# EAGLE design Hscope_102 (EAGLE 9.6.2)
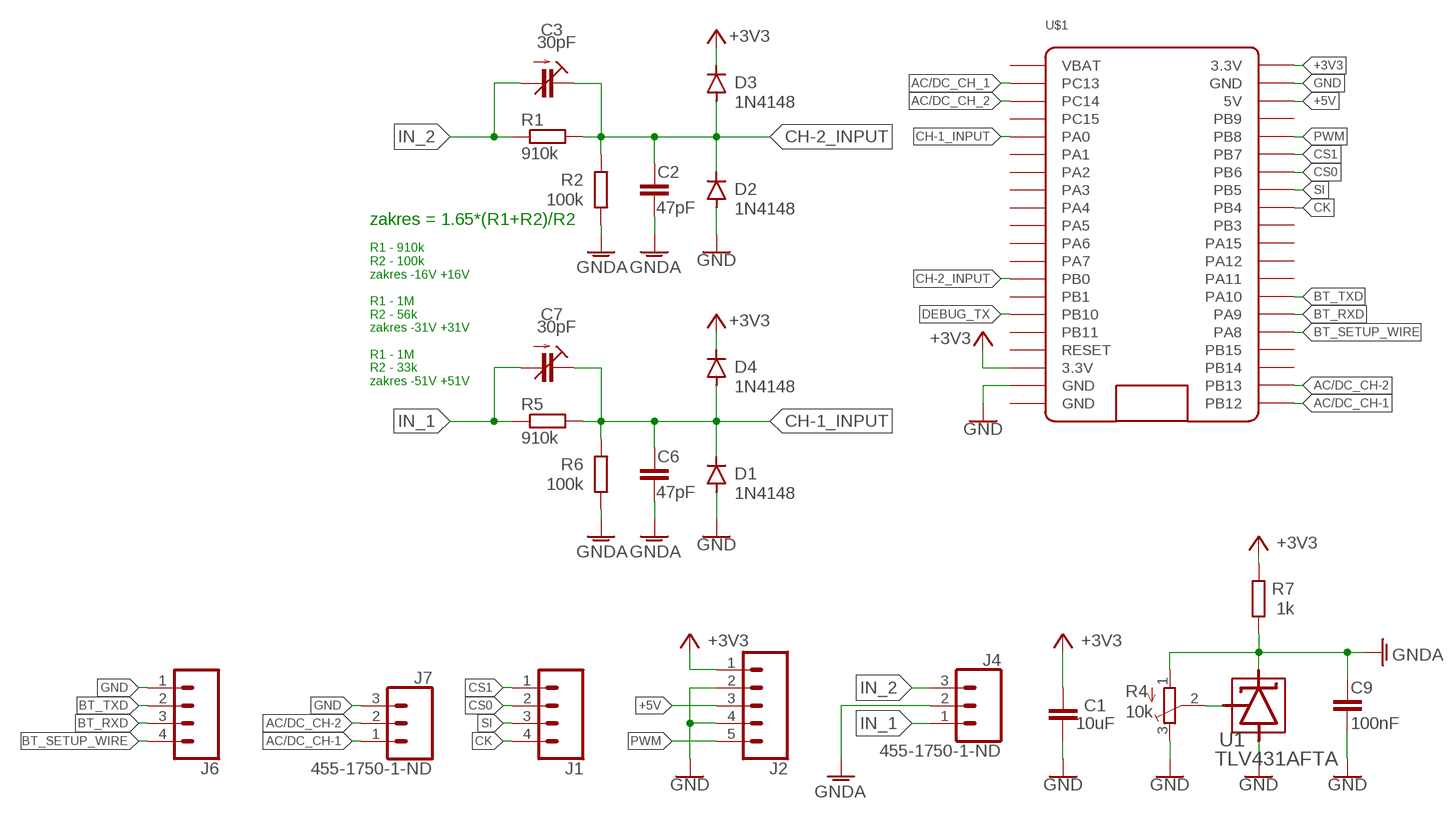
[diagram p0: schematic, sheet 1]

## Parts
C1  10uF  C-EUC0805  [C0805]
C2  47pF  C-EUC0805  [C0805]
C3  30pF  C-TRIMM3018_12  [CTRIM3018_12]
C6  47pF  C-EUC0805  [C0805]
C7  30pF  C-TRIMM3018_12  [CTRIM3018_12]
C9  100nF  C-EUC0805  [C0805]
D1  1N4148  DIODE-SOD323-W  [SOD323-W]
D2  1N4148  DIODE-SOD323-W  [SOD323-W]
D3  1N4148  DIODE-SOD323-W  [SOD323-W]
D4  1N4148  DIODE-SOD323-W  [SOD323-W]
J1  CONN_04PTH  [1X04]
J2  CONN_05  [1X05]
J4  455-1750-1-ND  CONN_03  [1X03]
J6  CONN_04PTH  [1X04]
J7  455-1750-1-ND  CONN_03  [1X03]
R1  910k  R-EU_R0805  [R0805]
R2  100k  R-EU_R0805  [R0805]
R4  10k  TRIM_EU-SM-42/43A  [SM-42/43A]
R5  910k  R-EU_R0805  [R0805]
R6  100k  R-EU_R0805  [R0805]
R7  1k  R-EU_R0805  [R0805]
U1  TLV431AFTA  [SOT95P237X112-3N]
U$1  STM32_BLUEPILL  [STM32_BLUEPILL]

## Nets
+3V3: C1.2 D3.C D4.C J2.1 R7.2 U$1.P$20(3.3V) U$1.P$23(3.3V)
+5V: J2.3 U$1.P$18(5V)
AC/DC_CH-1: J7.1 U$1.P$1(PB12)
AC/DC_CH-2: J7.2 U$1.P$2(PB13)
AC/DC_CH_1: U$1.P$39(PC13)
AC/DC_CH_2: U$1.P$38(PC14)
BT_RXD: J6.3 U$1.P$6(PA9)
BT_SETUP_WIRE: J6.4 U$1.P$5(PA8)
BT_TXD: J6.2 U$1.P$7(PA10)
CH-1_INPUT: C6.2 C7.+(E) D1.C D4.A R5.2 R6.2 U$1.P$36(PA0)
CH-2_INPUT: C2.2 C3.+(E) D2.C D3.A R1.2 R2.2 U$1.P$28(PB0)
CK: J1.4 U$1.P$12(PB4)
CS0: J1.2 U$1.P$14(PB6)
CS1: J1.1 U$1.P$15(PB7)
DEBUG_TX: U$1.P$26(PB10)
GND: C1.1 C9.1 D1.A D2.A J2.2 J2.4 J6.1 J7.3 R4.3(E) U1.3(ANODE) U$1.P$19(GND) U$1.P$22(GND)
GNDA: C2.1 C6.1 C9.2 J4.2 R2.1 R4.1(A) R6.1 R7.1 U1.2(CATHODE)
IN_1: C7.-(A) J4.1 R5.1
IN_2: C3.-(A) J4.3 R1.1
N$1: R4.2(S) U1.1(REF)
PWM: J2.5 U$1.P$16(PB8)
SI: J1.3 U$1.P$13(PB5)
Unconnected: U$1.P$3(PB14) U$1.P$4(PB15) U$1.P$8(PA11) U$1.P$9(PA12) U$1.P$10(PA15) U$1.P$11(PB3) U$1.P$17(PB9) U$1.P$24(RESET) U$1.P$25(PB11) U$1.P$27(PB1) U$1.P$29(PA7) U$1.P$30(PA6) U$1.P$31(PA5) U$1.P$32(PA4) U$1.P$33(PA3) U$1.P$34(PA2) U$1.P$35(PA1) U$1.P$37(PC15)

## Notes on the sheet
- zakres = 1.65*(R1+R2)/R2
- R1 - 910k
  R2 - 100k
  zakres -16V +16V
  
  R1 - 1M
  R2 - 56k
  zakres -31V +31V
  
  R1 - 1M
  R2 - 33k
  zakres -51V +51V

## Power pins joined to a net without a drawn wire
GND: U$1.P$21(GND)
VBAT: U$1.P$40(VBAT)

## Library data of the parts
C1 C2 C6 C9 = rlc:C-EU: CAPACITOR, European symbol
C3 C7 = rlc:C-TRIMM: Trimm capacitor
D1-D4 = diode:DIODE-: DIODE
J1 J6 = SparkFun-Connectors:CONN_04: Multi connection point. Often used as Generic Header-pin footprint for 0.1 inch spaced/style header connections On any of the 0.1 inch spaced packages, you can populate with these: Break Away Headers - Straight <https://www.sparkfun.com/products/116> (PRT-00116) Break Away Male Headers - Right Angle <https://www.sparkfun.com/products/553> (PRT-00553) Female Headers <https://www.sparkfun.com/products/115> (PRT-00115) Break Away Headers - Machine Pin <https://www.sparkfun.com/products/117> (PRT-00117) Break Away Female Headers - Swiss Machine Pin <https://www.sparkfun.com/products/743> (PRT-00743) For SCREWTERMINALS and SPRING TERMINALS visit here: Screw Terimnals on SparkFun.com <https://www.sparkfun.com/search/results?term=Screw+Terminals> (5mm/3.5mm/2.54mm spacing) This device is also useful as a general connection point to wire up your design to another part of your project. Our various solder wires solder well into these plated through hole pads. Hook-Up Wire - Assortment (Stranded, 22 AWG) <https://www.sparkfun.com/products/11375> (PRT-11375) Hook-Up Wire - Assortment (Solid Core, 22 AWG) <https://www.sparkfun.com/products/11367> (PRT-11367) View the entire wire category on our website here <https://www.sparkfun.com/categories/141> Special notes: Molex polarized connector foot print use with SKU : PRT-08231 with associated crimp pins and housings. 1MM SMD Version SKU: PRT-10208; PROD_ID: CONN-09696
J2 = SparkFun-Connectors:CONN_05: Multi connection point. Often used as Generic Header-pin footprint for 0.1 inch spaced/style header connections On any of the 0.1 inch spaced packages, you can populate with these: Break Away Headers - Straight <https://www.sparkfun.com/products/116> (PRT-00116) Break Away Male Headers - Right Angle <https://www.sparkfun.com/products/553> (PRT-00553) Female Headers <https://www.sparkfun.com/products/115> (PRT-00115) Break Away Headers - Machine Pin <https://www.sparkfun.com/products/117> (PRT-00117) Break Away Female Headers - Swiss Machine Pin <https://www.sparkfun.com/products/743> (PRT-00743) For SCREWTERMINALS and SPRING TERMINALS visit here: Screw Terimnals on SparkFun.com <https://www.sparkfun.com/search/results?term=Screw+Terminals> (5mm/3.5mm/2.54mm spacing) This device is also useful as a general connection point to wire up your design to another part of your project. Our various solder wires solder well into these plated through hole pads. Hook-Up Wire - Assortment (Stranded, 22 AWG) <https://www.sparkfun.com/products/11375> (PRT-11375) Hook-Up Wire - Assortment (Solid Core, 22 AWG) <https://www.sparkfun.com/products/11367> (PRT-11367) View the entire wire category on our website here <https://www.sparkfun.com/categories/141> Special notes: Molex polarized connector foot print use with SKU : PRT-08231 with associated crimp pins and housings. 1MM SMD Version SKU: PRT-10208
J4 J7 = SparkFun-Connectors:CONN_03: Multi connection point. Often used as Generic Header-pin footprint for 0.1 inch spaced/style header connections On any of the 0.1 inch spaced packages, you can populate with these: Break Away Headers - Straight <https://www.sparkfun.com/products/116> (PRT-00116) Break Away Male Headers - Right Angle <https://www.sparkfun.com/products/553> (PRT-00553) Female Headers <https://www.sparkfun.com/products/115> (PRT-00115) Break Away Headers - Machine Pin <https://www.sparkfun.com/products/117> (PRT-00117) Break Away Female Headers - Swiss Machine Pin <https://www.sparkfun.com/products/743> (PRT-00743) Stackable Header - 3 Pin (Female, 0.1") <https://www.sparkfun.com/products/13875> (PRT-13875) For SCREWTERMINALS and SPRING TERMINALS visit here: Screw Terimnals on SparkFun.com <https://www.sparkfun.com/search/results?term=Screw+Terminals> (5mm/3.5mm/2.54mm spacing) This device is also useful as a general connection point to wire up your design to another part of your project. Our various solder wires solder well into these plated through hole pads. Hook-Up Wire - Assortment (Stranded, 22 AWG) <https://www.sparkfun.com/products/11375> (PRT-11375) Hook-Up Wire - Assortment (Solid Core, 22 AWG) <https://www.sparkfun.com/products/11367> (PRT-11367) View the entire wire category on our website here <https://www.sparkfun.com/categories/141> Special notes: Molex polarized connector foot print use with SKU : PRT-08232 with associated crimp pins and housings.; PROD_ID: XXX-00000
R1 R2 R5-R7 = rlc:R-EU_: RESISTOR, European symbol
R4 = pot:TRIM_EU-: POTENTIOMETER
U1 = Diodes_Inc_By_element14_Batch_1:TLV431AFTA: SHUNT REGULATOR; MPN: TLV431AFTA; OC_FARNELL: 1904053; OC_NEWARK: 55T7345; PACKAGE: SOT-23-3; SUPPLIER: DIODES INC.
U$1 = STM32_BluePill:STM32_BLUEPILL

## Board
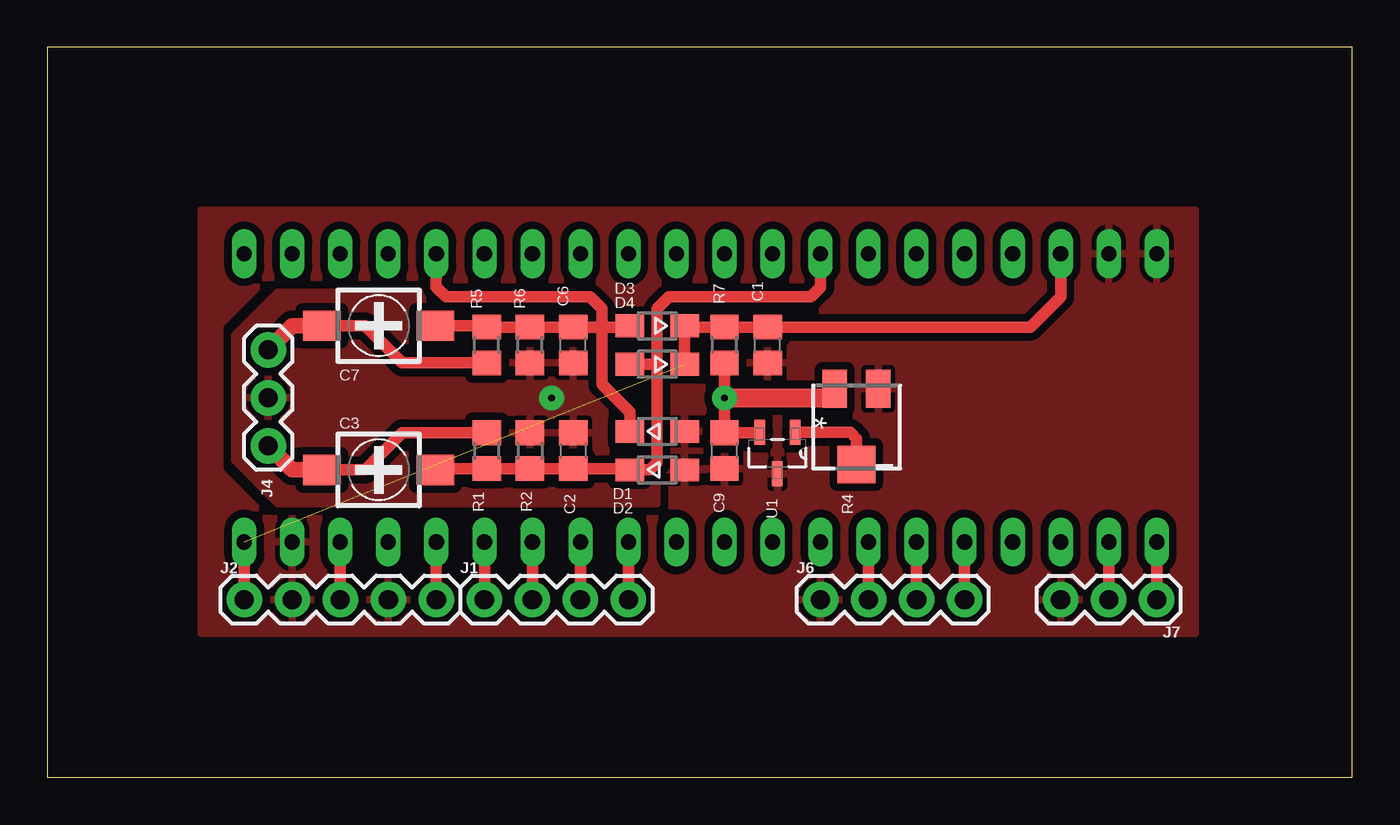
[diagram p1: board, top side]
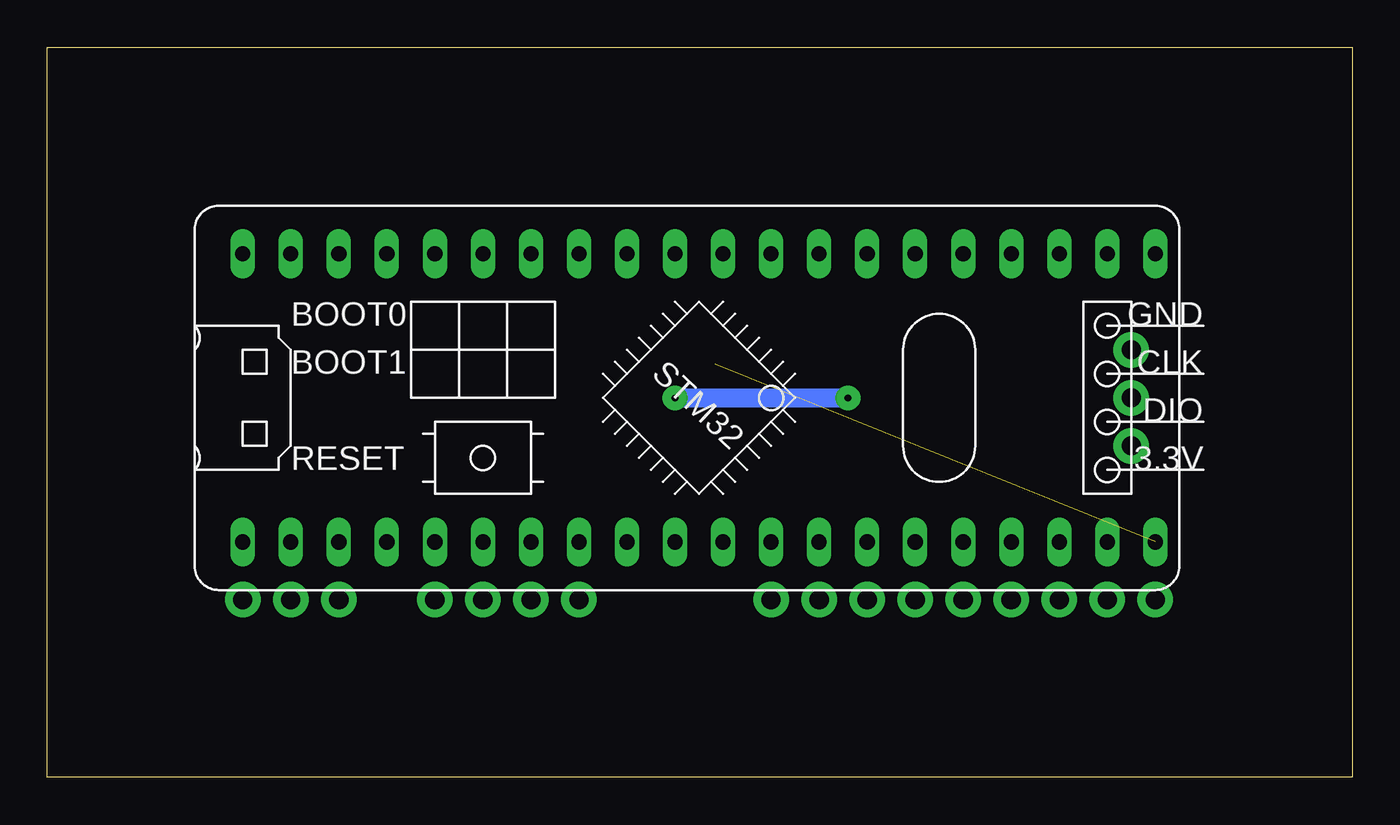
[diagram p2: board, bottom side, seen from below]

Size 69.01 x 38.6 mm. Coordinates in mm from the lower left corner, seen from the top.
Outline: 0,0 69.01,0 69.01,38.6 0,38.6 0,0
Copper layers (1*16): Top 0.035mm / dielectric 1.5mm / Bottom 0.035mm
Design rules "default": minimum track width 6mil, minimum drill 0.35mm, track to track 6mil, track to pad 6mil, pad to pad 6mil, via to via 6mil, smd to smd 6mil, copper to edge 40mil, drill to drill 6mil, minimum pad ring 10mil, minimum via ring 8mil, stop-mask expansion 4mil, vias tented up to drill 0mil, thermal gap 10mil

### Footprints (pad centres in the part's own frame; a part is rotated, then mirrored left to right if it is on the bottom)
C0805 = smd 1.3 x 1.5: 1 -0.95,0; 2 0.95,0
CTRIM3018_12 = smd 2 x 1.6: + -3,0; - 3,0
SOD323-W = smd 1.5 x 1.2: A 1.45,0; C -1.45,0
1X04 = drill 1.016 pad 1.88: 1 0,0; 2 2.54,0; 3 5.08,0; 4 7.62,0
1X05 = drill 1.016 pad 1.88: 1 0,0; 2 2.54,0; 3 5.08,0; 4 7.62,0; 5 10.16,0
1X03 = drill 1.016 pad 1.88: 1 0,0; 2 2.54,0; 3 5.08,0
R0805 = smd 1.3 x 1.5: 1 -0.95,0; 2 0.95,0
SM-42/43A = smd 2 x 1.3: 1 2,1.15; 3 2,-1.15 | smd 2 x 2: 2 -2,0
SOT95P237X112-3N = smd 1.321 x 0.559: 1 -1.092,0.94; 2 -1.092,-0.94; 3 1.092,0
STM32_BLUEPILL = drill 0.8 long: P$1 7.62,-24.13; P$2 7.62,-21.59; P$3 7.62,-19.05; P$4 7.62,-16.51; P$5 7.62,-13.97; P$6 7.62,-11.43; P$7 7.62,-8.89; P$8 7.62,-6.35; P$9 7.62,-3.81; P$10 7.62,-1.27; P$11 7.62,1.27; P$12 7.62,3.81; P$13 7.62,6.35; P$14 7.62,8.89; P$15 7.62,11.43; P$16 7.62,13.97; P$17 7.62,16.51; P$18 7.62,19.05; P$19 7.62,21.59; P$20 7.62,24.13; P$21 -7.62,-24.13; P$22 -7.62,-21.59; P$23 -7.62,-19.05; P$24 -7.62,-16.51; P$25 -7.62,-13.97; P$26 -7.62,-11.43; P$27 -7.62,-8.89; P$28 -7.62,-6.35; P$29 -7.62,-3.81; P$30 -7.62,-1.27; P$31 -7.62,1.27; P$32 -7.62,3.81; P$33 -7.62,6.35; P$34 -7.62,8.89; P$35 -7.62,11.43; P$36 -7.62,13.97; P$37 -7.62,16.51; P$38 -7.62,19.05; P$39 -7.62,21.59; P$40 -7.62,24.13

### Placement (x,y rotation side)
C1  38.1,22.86 90 top
C2  27.81,17.27 270 top
C3  17.53,16.26 180 top
C6  27.81,22.86 90 top
C7  17.53,23.88 180 top
C9  35.81,17.27 90 top
D1  32.26,18.29 0 top
D2  32.26,16.26 0 top
D3  32.26,21.84 180 top
D4  32.26,23.88 180 top
J1  23.11,9.4 0 top
J2  10.41,9.4 0 top
J4  11.68,22.61 270 top
J6  40.89,9.4 0 top
J7  58.67,9.4 180 top
R1  23.24,17.27 270 top
R2  25.53,17.27 270 top
R4  42.8,18.54 90 top
R5  23.24,22.86 90 top
R6  25.53,22.86 90 top
R7  35.81,22.86 90 top
U1  38.61,17.14 270 top
U$1  34.54,20.07 270 bottom

### Tracks (layer width: path | path; a pad name or v marks a point on that pad's centre or on a via)
+3V3  (1 unrouted)
  Top 0.406: D3.C 33.77,21.91
  Top 0.61: D3.C D4.C 33.77,23.81 R7.2 C1.2 52,23.81 53.59,25.4 U$1.P$23 | U$1.P$20 J2.1
+5V
  Top 0.61: U$1.P$18 J2.3
AC/DC_CH-1
  Top 0.61: J7.1 U$1.P$1
AC/DC_CH-2
  Top 0.61: J7.2 U$1.P$2
BT_RXD
  Top 0.61: J6.3 U$1.P$6
BT_SETUP_WIRE
  Top 0.61: J6.4 U$1.P$5
BT_TXD
  Top 0.61: J6.2 U$1.P$7
CH-1_INPUT
  Top 0.406: R5.2 23.17,23.88
  Top 0.61: R5.2 R6.2 C6.2 29.46,23.81 | 23.17,23.88 C7.+ 20.57,23.92 | 29.46,23.81 30.74,23.81 D4.A 30.73,23.95 | D1.C 30.81,19.3 29.34,20.77 29.34,23.68 | 29.34,23.68 29.46,23.81 | U$1.P$36 20.57,25.91 21.08,25.4 28.7,25.4 29.34,24.76 29.34,23.68
CH-2_INPUT
  Top 0.406: R1.2 23.21,16.4 | 20.57,16.32 20.57,16.3 | R2.2 25.27,16.07
  Top 0.508: C3.+ 20.57,16.3
  Top 0.61: 20.57,16.32 R1.2 R2.2 C2.2 30.74,16.32 D2.C 31.88,16.26 32.26,16.64 32.26,21.84 | 32.26,21.84 32.26,24.76 32.89,25.4 40.39,25.4 40.89,25.91 U$1.P$28 | D3.A 32.26,21.84
CK
  Top 0.61: U$1.P$12 J1.4
CS0
  Top 0.61: U$1.P$14 J1.2
CS1
  Top 0.61: U$1.P$15 J1.1
GND
  Top 0.406: 33.71,18.47 D1.A
  Top 0.61: 35.75,16.26 C9.1
  pour Top (isolate 0.406, rank 2): 8.13,7.62 60.71,7.62 60.71,29.97 8.13,29.97
GNDA  (via drill 0.35 pad 1.3)
  Top 0.61: R7.1 v35.81,20.07 C9.2 37.53,18.22 U1.2 | 41.17,20.07 R4.1
  Top 1.016: v35.81,20.07 41.17,20.07
  Bottom 1.016: v35.81,20.07 v26.67,20.07
  pour Top (isolate 0.406): 32.26,25.65 12.19,25.65 9.91,23.37 9.91,16.76 12.19,14.48 32.26,14.48
IN_1
  Top 0.61: C7.- 16.81,23.88 18.78,21.91 R5.1
  Top 0.813: C7.- 12.95,23.88 J4.1
IN_2
  Top 0.61: C3.- 16.81,16.26 18.78,18.22 R1.1
  Top 0.813: C3.- 12.95,16.26 J4.3
N$1
  Top 0.61: U1.1 42.47,18.24 42.8,17.91 R4.2
PWM
  Top 0.61: U$1.P$16 J2.5
SI
  Top 0.61: U$1.P$13 J1.3